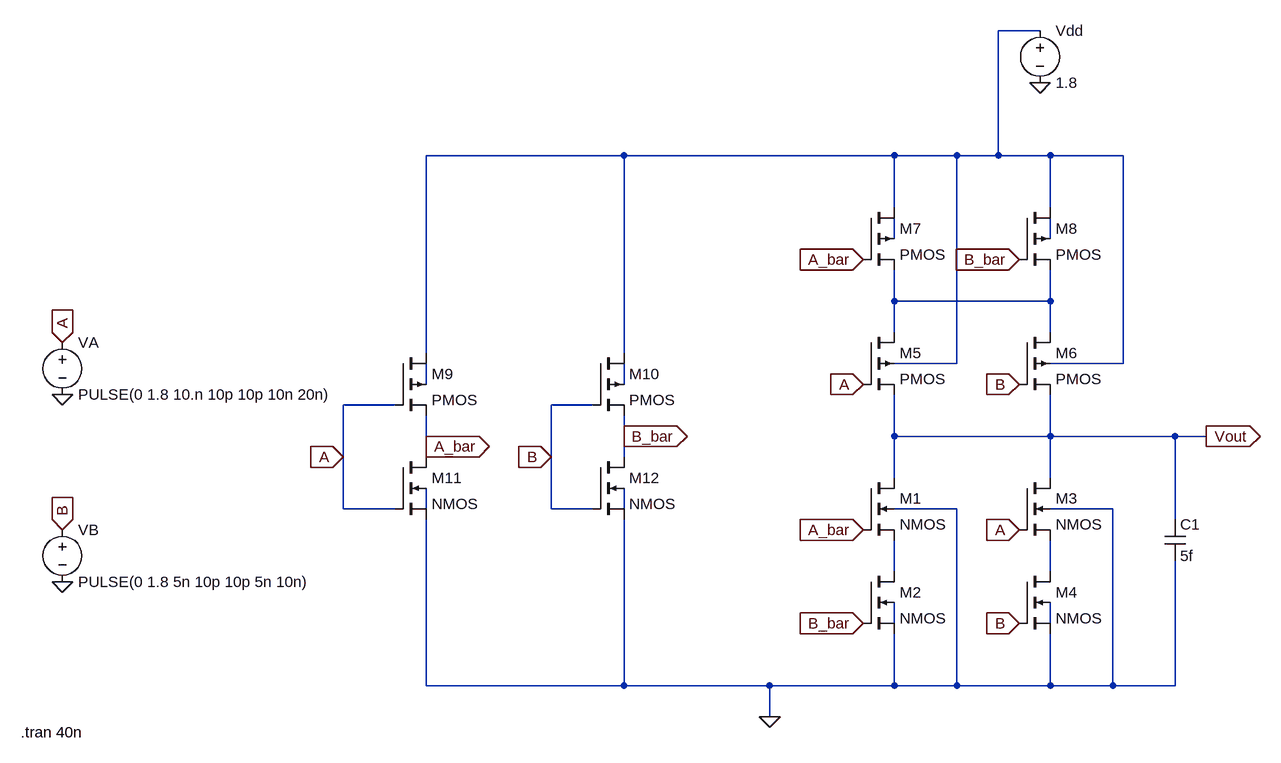
[diagram p0: schematic XOR.asc]
XOR.asc, the LTspice schematic file:
Version 4.1
SHEET 1 880 680
WIRE 416 -560 352 -560
WIRE -224 -368 -528 -368
WIRE 192 -368 -224 -368
WIRE 288 -368 192 -368
WIRE 352 -368 352 -560
WIRE 352 -368 288 -368
WIRE 432 -368 352 -368
WIRE 544 -368 432 -368
WIRE 192 -288 192 -368
WIRE 432 -288 432 -368
WIRE 192 -240 192 -272
WIRE 432 -240 432 -272
WIRE 192 -144 192 -192
WIRE 432 -144 432 -192
WIRE 432 -144 192 -144
WIRE 192 -96 192 -144
WIRE 432 -96 432 -144
WIRE -528 -64 -528 -368
WIRE -224 -64 -224 -368
WIRE 288 -48 288 -368
WIRE 288 -48 192 -48
WIRE 544 -48 544 -368
WIRE 544 -48 432 -48
WIRE -528 -16 -528 -48
WIRE -224 -16 -224 -48
WIRE -576 16 -656 16
WIRE -272 16 -336 16
WIRE -224 64 -224 32
WIRE 192 64 192 0
WIRE 432 64 432 0
WIRE 432 64 192 64
WIRE 624 64 432 64
WIRE 672 64 624 64
WIRE -528 80 -528 32
WIRE -656 96 -656 16
WIRE -528 96 -528 80
WIRE -336 96 -336 16
WIRE -224 96 -224 64
WIRE 192 128 192 64
WIRE 432 128 432 64
WIRE -656 176 -656 96
WIRE -576 176 -656 176
WIRE -528 176 -528 144
WIRE -336 176 -336 96
WIRE -272 176 -336 176
WIRE -224 176 -224 144
WIRE 288 176 192 176
WIRE 528 176 432 176
WIRE 624 192 624 64
WIRE 192 272 192 224
WIRE 432 272 432 224
WIRE 192 352 192 320
WIRE 432 352 432 320
WIRE -528 448 -528 192
WIRE -224 448 -224 192
WIRE -224 448 -528 448
WIRE 0 448 -224 448
WIRE 192 448 192 368
WIRE 192 448 0 448
WIRE 288 448 288 176
WIRE 288 448 192 448
WIRE 432 448 432 368
WIRE 432 448 288 448
WIRE 528 448 528 176
WIRE 528 448 432 448
WIRE 624 448 624 256
WIRE 624 448 528 448
WIRE 0 496 0 448
FLAG 0 496 0
FLAG -1088 0 0
FLAG -1088 288 0
FLAG 144 -16 A
IOPIN 144 -16 In
FLAG 384 208 A
IOPIN 384 208 In
FLAG -1088 -80 A
IOPIN -1088 -80 In
FLAG 384 -16 B
IOPIN 384 -16 In
FLAG 384 352 B
IOPIN 384 352 In
FLAG -1088 208 B
IOPIN -1088 208 In
FLAG -656 96 A
IOPIN -656 96 In
FLAG -336 96 B
IOPIN -336 96 In
FLAG -528 80 A_bar
IOPIN -528 80 Out
FLAG -224 64 B_bar
IOPIN -224 64 Out
FLAG 144 -208 A_bar
IOPIN 144 -208 In
FLAG 144 208 A_bar
IOPIN 144 208 In
FLAG 144 352 B_bar
IOPIN 144 352 In
FLAG 384 -208 B_bar
IOPIN 384 -208 In
FLAG 672 64 Vout
IOPIN 672 64 Out
FLAG 416 -480 0
SYMBOL nmos4 144 128 R0
SYMATTR InstName M1
SYMATTR Value2 l=180n w=800n
SYMBOL nmos4 144 272 R0
SYMATTR InstName M2
SYMATTR Value2 l=180n w=800n
SYMBOL nmos4 384 128 R0
SYMATTR InstName M3
SYMATTR Value2 l=180n w=800n
SYMBOL nmos4 384 272 R0
SYMATTR InstName M4
SYMATTR Value2 l=180n w=400n
SYMBOL pmos4 144 -96 R0
SYMATTR InstName M5
SYMATTR Value2 l=180n w=1600n
SYMBOL pmos4 384 -96 R0
SYMATTR InstName M6
SYMATTR Value2 l=180n w=1600n
SYMBOL pmos4 144 -288 R0
SYMATTR InstName M7
SYMATTR Value2 l=180n w=1600n
SYMBOL pmos4 384 -288 R0
SYMATTR InstName M8
SYMATTR Value2 l=180n w=1600n
SYMBOL voltage 416 -576 R0
WINDOW 123 0 0 Left 0
WINDOW 39 0 0 Left 0
SYMATTR InstName Vdd
SYMATTR Value 1.8
SYMBOL pmos4 -576 -64 R0
SYMATTR InstName M9
SYMATTR Value2 l=180n w=800n
SYMBOL pmos4 -272 -64 R0
SYMATTR InstName M10
SYMATTR Value2 l=180n w=800n
SYMBOL nmos4 -576 96 R0
SYMATTR InstName M11
SYMATTR Value2 l=180n w=400n
SYMBOL nmos4 -272 96 R0
SYMATTR InstName M12
SYMATTR Value2 l=180n w=400n
SYMBOL voltage -1088 -96 R0
WINDOW 123 0 0 Left 0
WINDOW 39 0 0 Left 0
SYMATTR InstName VA
SYMATTR Value PULSE(0 1.8 10.n 10p 10p 10n 20n)
SYMBOL voltage -1088 192 R0
WINDOW 123 0 0 Left 0
WINDOW 39 0 0 Left 0
SYMATTR InstName VB
SYMATTR Value PULSE(0 1.8 5n 10p 10p 5n 10n)
SYMBOL cap 608 192 R0
SYMATTR InstName C1
SYMATTR Value 5f
TEXT -1152 520 Left 2 !.tran 40n

The netlist it stands for:
* XOR.asc
M1 Vout A_bar N009 0 NMOS l=180n w=800n
M2 N009 B_bar 0 N011 NMOS l=180n w=800n
M3 Vout A N010 0 NMOS l=180n w=800n
M4 N010 B 0 N012 NMOS l=180n w=400n
M5 N004 A Vout N001 PMOS l=180n w=1600n
M6 N004 B Vout N001 PMOS l=180n w=1600n
M7 N001 A_bar N004 N002 PMOS l=180n w=1600n
M8 N001 B_bar N004 N003 PMOS l=180n w=1600n
Vdd N001 0 1.8
M9 N001 A A_bar N005 PMOS l=180n w=800n
M10 N001 B B_bar N006 PMOS l=180n w=800n
M11 A_bar A 0 N007 NMOS l=180n w=400n
M12 B_bar B 0 N008 NMOS l=180n w=400n
VA A 0 PULSE(0 1.8 10.n 10p 10p 10n 20n)
VB B 0 PULSE(0 1.8 5n 10p 10p 5n 10n)
C1 Vout 0 5f
.model NMOS NMOS
.model PMOS PMOS
.lib standard.mos
.tran 40n
.backanno
.end